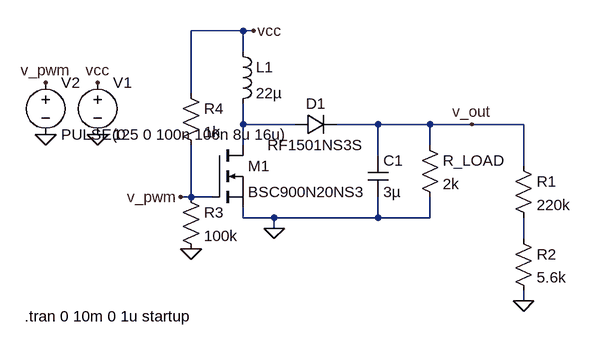
[diagram p0: schematic dc_dc boostArduino.asc]
dc_dc boostArduino.asc, the LTspice schematic file:
Version 4
SHEET 1 1568 680
WIRE 624 -192 544 -192
WIRE 640 -192 624 -192
WIRE 624 -160 624 -192
WIRE 544 -96 544 -192
WIRE 624 -48 624 -80
WIRE 704 -48 624 -48
WIRE 832 -48 768 -48
WIRE 912 -48 832 -48
WIRE 976 -48 912 -48
WIRE 1056 -48 976 -48
WIRE 624 -16 624 -48
WIRE 912 -16 912 -48
WIRE 832 0 832 -48
WIRE 1056 16 1056 -48
WIRE 544 64 544 -16
WIRE 544 64 528 64
WIRE 576 64 544 64
WIRE 624 96 624 80
WIRE 672 96 624 96
WIRE 832 96 832 64
WIRE 832 96 672 96
WIRE 912 96 912 64
WIRE 912 96 832 96
WIRE 672 112 672 96
WIRE 1056 128 1056 96
WIRE 1056 224 1056 208
FLAG 640 -192 vcc
FLAG 976 -48 v_out
FLAG 400 -112 vcc
FLAG 400 -32 0
FLAG 1056 224 0
FLAG 528 64 v_pwm
FLAG 672 112 0
FLAG 320 -32 0
FLAG 320 -112 v_pwm
FLAG 544 144 0
SYMBOL nmos 576 -16 R0
SYMATTR InstName M1
SYMATTR Value BSC900N20NS3
SYMBOL ind 608 -176 R0
SYMATTR InstName L1
SYMATTR Value 22µ
SYMBOL diode 704 -32 R270
WINDOW 0 32 32 VTop 2
WINDOW 3 0 32 VBottom 2
SYMATTR InstName D1
SYMATTR Value RF1501NS3S
SYMBOL res 896 -32 R0
SYMATTR InstName R_LOAD
SYMATTR Value 2k
SYMBOL cap 816 0 R0
SYMATTR InstName C1
SYMATTR Value 3µ
SYMATTR SpiceLine V=200 Irms=5.06 Rser=0.0268854 Lser=0
SYMBOL voltage 400 -128 R0
WINDOW 123 0 0 Left 2
WINDOW 39 24 44 Left 2
SYMATTR InstName V1
SYMATTR Value 12
SYMBOL res 1040 0 R0
SYMATTR InstName R1
SYMATTR Value 220k
SYMBOL res 1040 112 R0
SYMATTR InstName R2
SYMATTR Value 5.6k
SYMBOL res 528 -112 R0
SYMATTR InstName R4
SYMATTR Value 1k
SYMBOL voltage 320 -128 R0
WINDOW 123 0 0 Left 2
WINDOW 39 0 0 Left 2
SYMATTR InstName V2
SYMATTR Value PULSE(0 5 0 100n 100n 8u 16u)
SYMBOL res 528 48 R0
SYMATTR InstName R3
SYMATTR Value 100k
TEXT 288 248 Left 2 !.tran 0 10m 0 1u startup

The netlist it stands for:
* dc_dc boostArduino.asc
M1 N001 v_pwm 0 0 BSC900N20NS3
L1 vcc N001 22µ
D1 N001 v_out RF1501NS3S
R_LOAD v_out 0 2k
C1 v_out 0 3µ V=200 Irms=5.06 Rser=0.0268854 Lser=0
V1 vcc 0 12
R1 v_out N002 220k
R2 N002 0 5.6k
R4 vcc v_pwm 1k
V2 v_pwm 0 PULSE(0 5 0 100n 100n 8u 16u)
R3 v_pwm 0 100k
.model D D
.lib standard.dio
.model NMOS NMOS
.model PMOS PMOS
.lib standard.mos
.tran 0 10m 0 1u startup
.backanno
.end